# EAGLE design MegaShield (EAGLE 5.10)
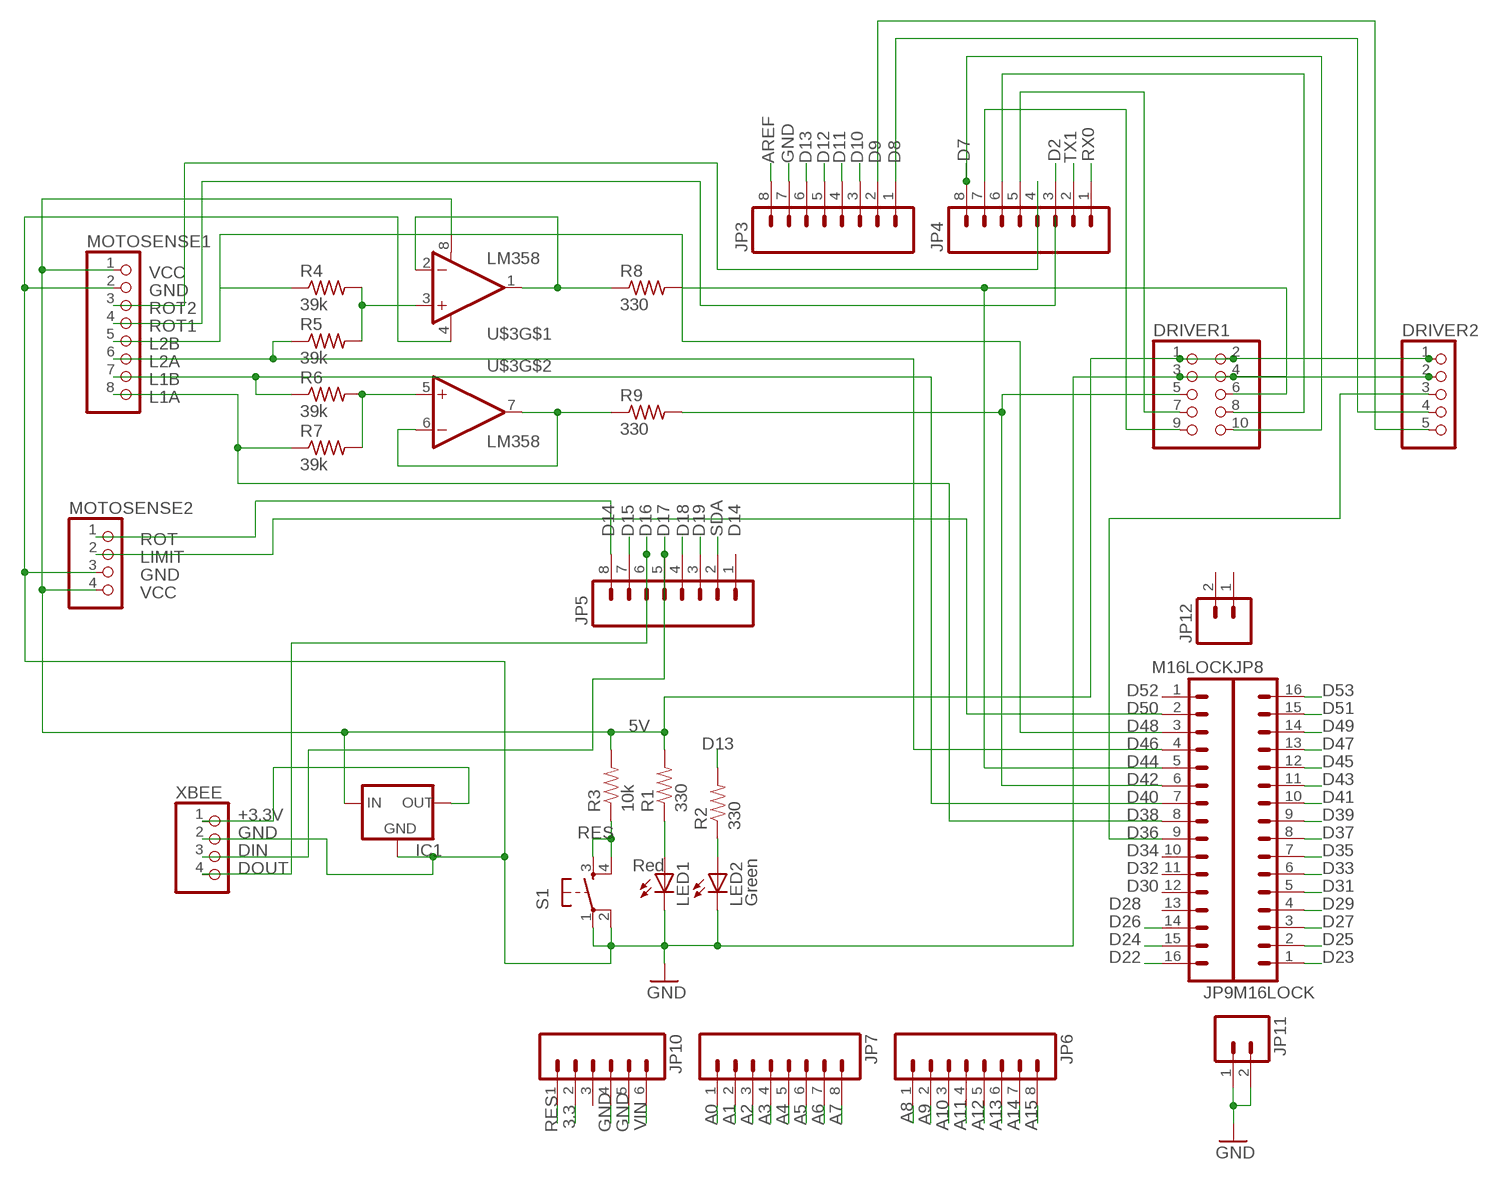
[diagram p0: schematic, sheet 1]

## Parts
DRIVER1  PINHD-2X5  [2X05]
DRIVER2  PINHD-1X5  [1X05]
IC1  V_REG_78XXSIDE  [78XXL]
JP3  M08LOCK  [1X08_LOCK]
JP4  M08LOCK  [1X08_LOCK]
JP5  M08LOCK  [1X08_LOCK]
JP6  M08LOCK  [1X08_LOCK]
JP7  M08LOCK  [1X08_LOCK]
JP8  M16LOCK  [1X16_LOCK]
JP9  M16LOCK  [1X16_LOCK]
JP10  M06LOCK  [1X06_LOCK]
JP11  M02LOCK  [1X02_LOCK]
JP12  M02LOCK  [1X02_LOCK]
LED1  Red  LED5MM  [LED5MM]
LED2  Green  LED5MM  [LED5MM]
MOTOSENSE1  PINHD-1X8/90  [1X08/90]
MOTOSENSE2  PINHD-1X4/90  [1X04/90]
R1  330  RESISTORPTH1  [AXIAL-0.3]
R2  330  RESISTORPTH1  [AXIAL-0.3]
R3  10k  RESISTORPTH1  [AXIAL-0.3]
R4  39k  R-US_0207/7  [0207/7]
R5  39k  R-US_0207/7  [0207/7]
R6  39k  R-US_0207/7  [0207/7]
R7  39k  R-US_0207/7  [0207/7]
R8  330  R-US_0204/7  [0204/7]
R9  330  R-US_0204/7  [0204/7]
S1  TAC_SWITCHPTH  [TACTILE-PTH]
U$3  LM358  [DIP08]
XBEE  PINHD-1X4/90  [1X04/90]

## Nets
3.3: JP10.2
5V: DRIVER1.1 DRIVER1.2 DRIVER2.1 IC1.IN MOTOSENSE1.1 MOTOSENSE2.4 R1.P$2 R3.P$2 U$3.8(V+)
A0: JP7.1
A1: JP7.2
A2: JP7.3
A3: JP7.4
A4: JP7.5
A5: JP7.6
A6: JP7.7
A7: JP7.8
A8: JP6.1
A9: JP6.2
A10: JP6.3
A11: JP6.4
A12: JP6.5
A13: JP6.6
A14: JP6.7
A15: JP6.8
AREF: JP3.8
D2: JP4.3
D7: DRIVER1.10 JP4.8
D8: DRIVER2.4 JP3.1
D9: DRIVER2.5 JP3.2
D10: JP3.3
D11: JP3.4
D12: JP3.5
D13: JP3.6 R2.P$2
D14: JP5.8 MOTOSENSE2.1
D15: JP5.7
D16: JP5.6 XBEE.4
D17: JP5.5 XBEE.3
D18: JP5.4
D19: JP5.3
D22: DRIVER2.3 JP9.9
D23: JP8.16
D24: DRIVER1.5 JP9.6 R9.2
D25: JP8.15
D27: JP8.14
D29: JP8.13
D31: JP8.12
D33: JP8.11
D35: JP8.10
D37: JP8.9
D39: JP8.8
D41: JP8.7
D43: JP8.6
D45: JP8.5
D47: JP8.4
D48: JP9.14
D49: JP8.3
D50: JP9.15
D51: JP8.2
D52: JP9.16
D53: JP8.1
GND: DRIVER1.3 DRIVER1.4 DRIVER2.2 IC1.GND JP3.7 JP10.4 JP10.5 JP11.1 JP11.2 LED1.K(C) LED2.K(C) MOTOSENSE1.2 MOTOSENSE2.3 S1.1 S1.2 U$3.4(V-) XBEE.2
N$1: JP9.4 MOTOSENSE1.6 R5.1
N$3: JP9.7 MOTOSENSE1.7 R6.1
N$4: JP9.3 MOTOSENSE1.5 R4.1
N$5: R4.2 R5.2 U$3.3(+IN)
N$6: JP9.8 MOTOSENSE1.8 R7.1
N$8: DRIVER1.7 JP4.5
N$9: DRIVER1.6 JP9.5 R8.2
N$10: DRIVER1.8 JP4.6
N$11: DRIVER1.9 JP4.7
N$12: JP9.2 MOTOSENSE2.2
N$17: JP4.4 MOTOSENSE1.3
N$21: MOTOSENSE1.4
N$85: R6.2 R7.2 U$3.5(+IN)
N$97: R8.1 U$3.1(OUT) U$3.2(-IN)
N$108: R9.1 U$3.6(-IN) U$3.7(OUT)
N$109: IC1.OUT XBEE.1
N$126: LED1.A R1.P$1
N$127: LED2.A R2.P$1
RES: JP10.1 R3.P$1 S1.3 S1.4
RX0: JP4.1
SDA: JP5.2
TX1: JP4.2
VIN: JP10.6
Unconnected: JP5.1 JP9.1 JP9.10 JP9.11 JP9.12 JP9.13 JP10.3 JP12.1 JP12.2

## Notes on the sheet
- VCC
- GND
- ROT2
- ROT1
- L2B
- L2A
- L1B
- L1A
- ROT
- LIMIT
- GND
- VCC
- D52 | D53
- D50 | D51
- D48 | D49
- D46 | D47
- D44 | D45
- D42 | D43
- D40 | D41
- +3.3V | D38 | D39
- GND | D36 | D37
- DIN | D34 | D35
- DOUT | D32 | D33
- D30 | D31
- D28 | D29
- D26 | D27
- D24 | D25
- D22 | D23

## Library data of the parts
DRIVER1 = pinhead:PINHD-2X5: PIN HEADER
DRIVER2 = pinhead:PINHD-1X5: PIN HEADER
IC1 = SparkFun:V_REG_78XX: Voltage Regulator Standard 7805 5V regulator. IGO (Input Ground Output). Spark Fun Electronics SKU : COM-00107
JP3-JP7 = SparkFun:M08: Header 8 Standard 8-pin 0.1" header. Use with straight break away headers (SKU : PRT-00116), right angle break away headers (PRT-00553), swiss pins (PRT-00743), machine pins (PRT-00117), and female headers (PRT-00115).
JP8 JP9 = SparkFun:M16
JP10 = SparkFun:M06: Header 6 Standard 6-pin 0.1" header. Use with straight break away headers (SKU : PRT-00116), right angle break away headers (PRT-00553), swiss pins (PRT-00743), machine pins (PRT-00117), and female headers (PRT-00115). Molex polarized connector foot print use with SKU : PRT-08094 with associated crimp pins and housings. NOTES ON THE VARIANTS LOCK and LOCK_LONGPADS... This footprint was designed to help hold the alignment of a through-hole component (i.e. 6-pin header) while soldering it into place. You may notice that each hole has been shifted either up or down by 0.005 of an inch from it's more standard position (which is a perfectly straight line). This slight alteration caused the pins (the squares in the middle) to touch the edges of the holes. Because they are alternating, it causes a "brace" to hold the component in place. 0.005 has proven to be the perfect amount of "off-center" position when using our standard breakaway headers. Although looks a little odd when you look at the bare footprint, once you have a header in there, the alteration is very hard to notice. Also, if you push a header all the way into place, it is covered up entirely on the bottom side. This idea of altering the position of holes to aid alignment will be further integrated into the Sparkfun Library for other footprints. It can help hold any component with 3 or more connection pins.
JP11 JP12 = SparkFun:M02: Header 2 Standard 2-pin 0.1" header. Use with straight break away headers (SKU : PRT-00116), right angle break away headers (PRT-00553), swiss pins (PRT-00743), machine pins (PRT-00117), and female headers (PRT-00115). Molex polarized connector foot print use with SKU : PRT-08233 with associated crimp pins and housings.
LED1 LED2 = SparkFun:LED: LEDs Standard schematic elements and footprints for 5mm, 3mm, 1206, and 0603 sized LEDs. 5mm - Spark Fun Electronics SKU : COM-00529 (and others)
MOTOSENSE1 = pinhead:PINHD-1X8: PIN HEADER
MOTOSENSE2 XBEE = pinhead:PINHD-1X4: PIN HEADER
R1-R3 = SparkFun:RESISTOR: Resistor Basic schematic elements and footprints for 0603, 1206, and PTH 1/10th watt (small) resistors.
R4-R9 = adafruit:R-US_: RESISTOR, American symbol
S1 = SparkFun:TAC_SWITCH: Momentary Switch Button commonly used for reset or general input. Spark Fun Electronics SKU : COM-00097
U$3 = SparkFun:LM358

## Net classes
0 default: width 0.152 mm, drill 0.305 mm, clearance 0.152 mm

## Board
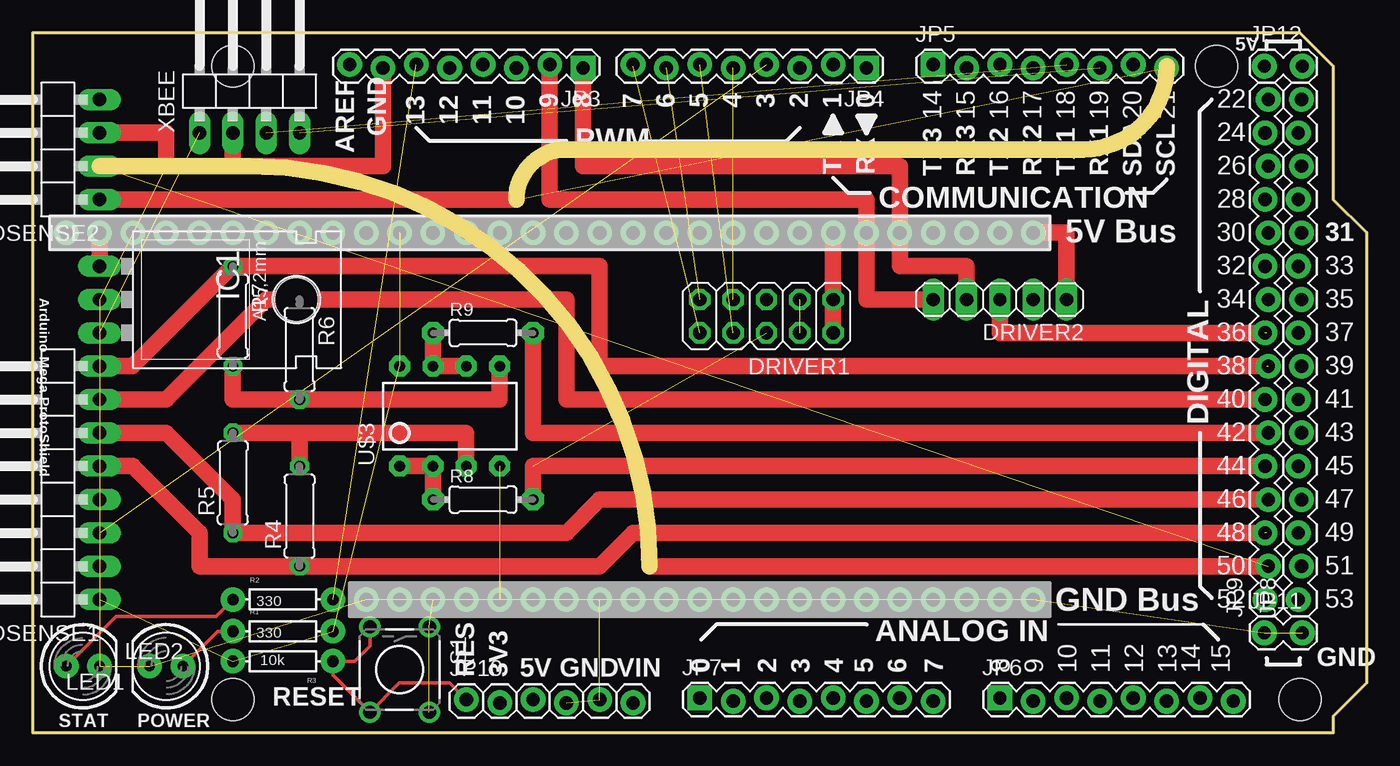
[diagram p1: board, top side]
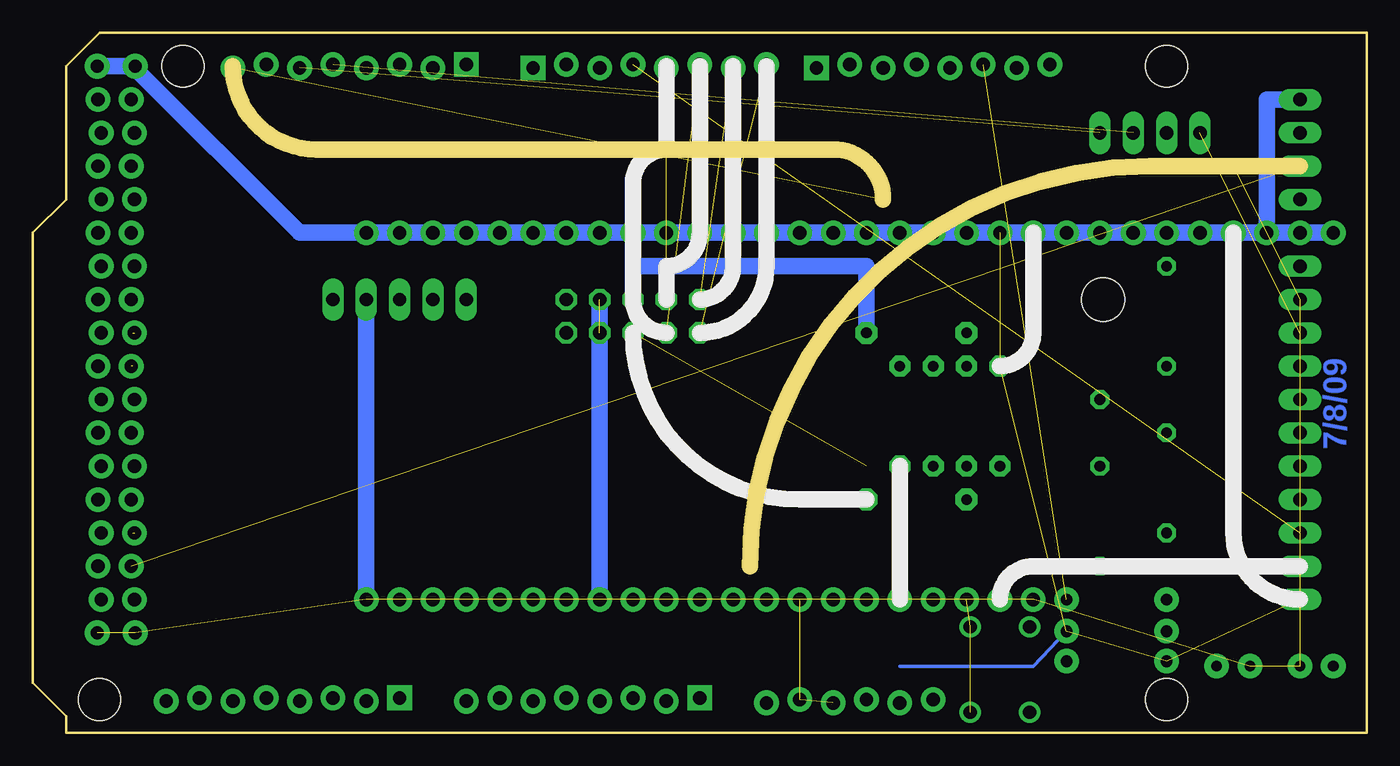
[diagram p2: board, bottom side, seen from below]

Size 101.6 x 53.34 mm. Coordinates in mm from the lower left corner, seen from the top.
Outline: 0,0 99.06,0 99.06,1.27 101.6,3.81 101.6,38.1 99.06,40.64 99.06,50.8 96.52,53.34 0,53.34 0,0
Copper layers (1*16): Top 0.035mm / dielectric 1.5mm / Bottom 0.035mm
Design rules "SparkFun": minimum track width 8mil, minimum drill 20mil, track to track 8mil, track to pad 8mil, pad to pad 8mil, via to via 8mil, smd to smd 8mil, copper to edge 10mil, drill to drill 8mil, minimum pad ring 12mil, minimum via ring 10mil, stop-mask expansion 4mil, vias tented up to drill 25mil, thermal gap 10mil
Holes 3.2 mm at 15.24,50.8 15.24,2.54 90.17,50.8 96.52,2.54
Milling: 5 lines

### Footprints (pad centres in the part's own frame; a part is rotated, then mirrored left to right if it is on the bottom)
2X05 = drill 1.016 octagon: 1 -5.08,-1.27; 2 -5.08,1.27; 3 -2.54,-1.27; 4 -2.54,1.27; 5 0,-1.27; 6 0,1.27; 7 2.54,-1.27; 8 2.54,1.27; 9 5.08,-1.27; 10 5.08,1.27
1X05 = drill 1.016 long: 1 -5.08,0; 2 -2.54,0; 3 0,0; 4 2.54,0; 5 5.08,0
78XXL = drill 1.016 long: GND 0,-3.81; IN -2.54,-3.81; OUT 2.54,-3.81 | hole 3.302: 0,11.176
1X08_LOCK = drill 1.016 pad 1.88 square: 1 0,0.127 | drill 1.016 pad 1.88 round: 2 2.54,-0.127; 3 5.08,0.127; 4 7.62,-0.127; 5 10.16,0.127; 6 12.7,-0.127; 7 15.24,0.127; 8 17.78,-0.127
1X16_LOCK = drill 1.016 pad 1.88 round: 1 0,0.127; 2 2.54,-0.127; 3 5.08,0.127; 4 7.62,-0.127; 5 10.16,0.127; 6 12.7,-0.127; 7 15.24,0.127; 8 17.78,-0.127; 9 20.32,0.127; 10 22.86,-0.127; 11 25.4,0.127; 12 27.94,-0.127; 13 30.48,0.127; 14 33.02,-0.127; 15 35.56,0.127; 16 38.1,-0.127
1X06_LOCK = drill 1.016 pad 1.88 round: 1 0,0; 2 2.54,-0.254; 3 5.08,0; 4 7.62,-0.254; 5 10.16,0; 6 12.7,-0.254
1X02_LOCK = drill 1.016 pad 1.88 round: 1 -0.178,0; 2 2.718,0
LED5MM = drill 0.813 pad 1.88 round: A -1.27,0; K 1.27,0
1X08/90 = drill 1.016 long: 1 -8.89,-3.81; 2 -6.35,-3.81; 3 -3.81,-3.81; 4 -1.27,-3.81; 5 1.27,-3.81; 6 3.81,-3.81; 7 6.35,-3.81; 8 8.89,-3.81
1X04/90 = drill 1.016 long: 1 -3.81,-3.81; 2 -1.27,-3.81; 3 1.27,-3.81; 4 3.81,-3.81
AXIAL-0.3 = drill 0.9 pad 1.88 round: P$1 -3.81,0; P$2 3.81,0
0207/7 = drill 0.813 octagon: 1 -3.81,0; 2 3.81,0
0204/7 = drill 0.813 pad 1.676 octagon: 1 -3.81,0; 2 3.81,0
TACTILE-PTH = drill 1.016 round: 1 -3.251,2.261; 2 3.251,2.261; 3 -3.251,-2.261; 4 3.251,-2.261
DIP08 = drill 0.813 pad 1.6 octagon: 1 -3.81,-3.81; 2 -1.27,-3.81; 3 1.27,-3.81; 4 3.81,-3.81; 5 3.81,3.81; 6 1.27,3.81; 7 -1.27,3.81; 8 -3.81,3.81

### Placement (x,y rotation side)
DRIVER1  55.88,31.75 180 top
DRIVER2  73.66,33.02 180 top
IC1  8.89,33.02 270 top
JP3  41.91,50.8 180 top
JP4  63.5,50.8 180 top
JP5  68.58,50.8 0 top
JP6  73.66,2.54 0 top
JP7  50.8,2.54 0 top
JP8  96.52,10.16 90 top
JP9  93.98,10.16 90 top
JP10  33.02,2.54 0 top
JP11  93.98,7.62 0 top
JP12  93.98,50.8 0 top
LED1  10.16,5.08 180 top
LED2  3.81,5.08 0 top
MOTOSENSE1  1.27,19.05 90 top
MOTOSENSE2  1.27,44.45 90 top
R1  19.05,7.75 0 top
R2  19.05,10.16 0 top
R3  19.05,5.46 180 top
R4  20.32,16.51 90 top
R5  15.24,19.05 90 top
R6  20.32,29.21 270 top
R7  15.24,31.75 270 top
R8  34.29,17.78 0 top
R9  34.29,30.48 0 top
S1  27.94,4.83 270 top
U$3  31.75,24.13 0 top
XBEE  16.51,49.53 0 top

### Tracks (layer width: path | path; a pad name or v marks a point on that pad's centre or on a via)
3.3
  Top 0.203: JP10.2 35.56,2.54 JP10.2
5V  (via drill 1.02 pad 1.88)  (4 unrouted)
  Top 1.27: DRIVER2.1 78.74,38.1 v76.2,38.1 | DRIVER1.2 DRIVER1.1 v60.96,38.1 | IC1.IN v5.08,38.1
  Bottom 0.254: R1.P$2 25.4,5.08 35.56,5.08
  Bottom 1.27: v7.62,38.1 v10.16,38.1 v12.7,38.1 v15.24,38.1 v17.78,38.1 v20.32,38.1 v22.86,38.1 v25.4,38.1 v27.94,38.1 v30.48,38.1 v33.02,38.1 v35.56,38.1 v38.1,38.1 v40.64,38.1 v43.18,38.1 v45.72,38.1 v48.26,38.1 v50.8,38.1 v53.34,38.1 v55.88,38.1 v58.42,38.1 v60.96,38.1 v63.5,38.1 v66.04,38.1 v68.58,38.1 v71.12,38.1 v73.66,38.1 v76.2,38.1 81.28,38.1 93.98,50.8 96.52,50.8 | v7.62,38.1 v5.08,38.1 v2.54,38.1 | v7.62,38.1 7.62,48.26 MOTOSENSE2.4
A0
  Top 0.203: JP7.1 50.8,2.54
A1
  Top 0.203: JP7.2 53.34,2.54 JP7.2
A2
  Top 0.203: JP7.3 55.88,2.54
A3
  Top 0.203: JP7.4 58.42,2.54 JP7.4
A4
  Top 0.203: JP7.5 60.96,2.54
A5
  Top 0.203: JP7.6 63.5,2.54 JP7.6
A6
  Top 0.203: JP7.7 66.04,2.54
A7
  Top 0.203: JP7.8 68.58,2.54 JP7.8
A8
  Top 0.203: JP6.1 73.66,2.54
A9
  Top 0.203: JP6.2 76.2,2.54 JP6.2
A10
  Top 0.203: JP6.3 78.74,2.54
A11
  Top 0.203: JP6.4 81.28,2.54 JP6.4
A12
  Top 0.203: JP6.5 83.82,2.54
A13
  Top 0.203: JP6.6 86.36,2.54 JP6.6
A14
  Top 0.203: JP6.7 88.9,2.54
A15
  Top 0.203: JP6.8 91.44,2.54 JP6.8
AREF
  Top 0.203: JP3.8 24.13,50.8 JP3.8
D2
  Top 0.203: JP4.3 58.42,50.8
D7  (1 unrouted)
  Top 0.203: JP4.8 45.72,50.8 JP4.8
D8
  Top 0.203: 41.91,50.8 JP3.1
  Top 1.27: DRIVER2.4 71.12,35.56 66.04,35.56 66.04,43.18 41.91,43.18 41.91,50.8
D9
  Top 0.203: 39.37,50.8 JP3.2
  Top 1.27: DRIVER2.5 63.5,33.02 63.5,40.64 39.37,40.64 39.37,50.8
D10
  Top 0.203: JP3.3 36.83,50.8
D11
  Top 0.203: JP3.4 34.29,50.8 JP3.4
D12
  Top 0.203: JP3.5 31.75,50.8
D13  (1 unrouted)
D14  (1 unrouted)
  Top 0.203: JP5.8 86.36,50.8
  Top 1.27: MOTOSENSE2.1 36.83,40.64
D15
  Top 0.203: JP5.7 83.82,50.8 JP5.7
D16  (1 unrouted)
  Top 0.203: JP5.6 81.28,50.8
D17  (1 unrouted)
  Top 0.203: JP5.5 78.74,50.8
D18
  Top 0.203: JP5.4 76.2,50.8
D19
  Top 0.203: JP5.3 73.66,50.8 JP5.3
D22  (1 unrouted)
  Top 1.27: DRIVER2.3 73.66,30.48 93.98,30.48
D24
  Top 1.27: R9.2 38.1,22.86 JP9.6
  Bottom 1.27: R9.2 38.1,35.56 55.88,35.56 DRIVER1.5
GND  (via drill 1.02 pad 1.88)  (33 unrouted)
  Top 1.27: MOTOSENSE2.3 10.16,45.72 10.16,43.18 15.24,43.18 | 15.24,43.18 XBEE.2 | JP3.7 26.67,43.18 15.24,43.18
  Bottom 1.27: v58.42,10.16 DRIVER1.3 | v76.2,10.16 DRIVER2.2
  other vias: 73.66,10.16 71.12,10.16 68.58,10.16 66.04,10.16 63.5,10.16 60.96,10.16 55.88,10.16 53.34,10.16 50.8,10.16 48.26,10.16 45.72,10.16 43.18,10.16 40.64,10.16 38.1,10.16 35.56,10.16 33.02,10.16 25.4,10.16 27.94,10.16 30.48,10.16
N$1
  Top 1.27: MOTOSENSE1.6 10.16,22.86 15.24,17.78 R5.1 40.64,15.24 43.18,17.78 JP9.4
N$3
  Top 1.27: MOTOSENSE1.7 10.16,25.4 17.78,33.02 R6.1 40.64,33.02 40.64,25.4 JP9.7
N$4  (1 unrouted)
  Top 1.27: MOTOSENSE1.5 7.62,20.32 12.7,15.24 12.7,12.7 R4.1 43.18,12.7 45.72,15.24 93.98,15.24
N$5
  Top 1.27: R5.2 20.32,22.86 | 20.32,22.86 R4.2 | 20.32,22.86 33.02,22.86 U$3.3
N$6  (1 unrouted)
  Top 1.27: MOTOSENSE1.8 7.62,27.94 R7.1 43.18,35.56 43.18,27.94 93.98,27.94
N$8  (1 unrouted)
N$9  (1 unrouted)
  Top 1.27: R8.2 38.1,20.32 JP9.5
N$10  (1 unrouted)
N$11  (1 unrouted)
N$12  (1 unrouted)
N$13
  Top 1.27: 93.98,12.7 46.99,12.7
N$17  (1 unrouted)
N$85
  Top 1.27: R7.2 15.24,25.4 R6.2 35.56,25.4 U$3.5
N$97
  Top 1.27: R8.1 U$3.2 U$3.1
N$108
  Top 1.27: R9.1 U$3.7 U$3.6
N$109  (1 unrouted)
N$126
  Top 0.254: R1.P$1 14.1,7.75 LED1.A
N$127
  Top 0.254: R2.P$1 13.97,8.89 6.35,8.89 LED2.A
RES
  Top 0.254: JP10.1 31.75,3.81 27.91,3.81 S1.4 22.86,4.39 R3.P$1 24.51,5.46 25.68,6.63 S1.3
RX0
  Top 0.203: JP4.1 63.5,50.8
SDA
  Top 0.203: JP5.2 71.12,50.8
TX1
  Top 0.203: JP4.2 60.96,50.8
VIN
  Top 0.203: JP10.6 45.72,2.54 JP10.6

### Text on the board
Bottom: 7/8/09
tPlace: 5V | 9 | 8 | 7 | 6 | 5 | 4 | 3 | 2 | 1 | 0 | 22 | 14 | 15 | 16 | 17 | 18 | 19 | 20 | 21 | 13 | 12 | 11 | 10 | GND | 24 | AREF | PWM | TX | RX | 26 | TX3 | RX3 | TX2 | RX2 | TX1 | RX1 | SDA | SCL | COMMUNICATION | 28 | 5V Bus | 30 | 31 | 32 | 33 | Arduino Mega ProtoShield | 34 | 35 | 36 | 37 | 38 | 39 | 40 | 41 | DIGITAL | 42 | 43 | 44 | 45 | 46 | 47 | 48 | 49 | 50 | 51 | 52 | 53 | GND Bus | ANALOG IN | 0 | 1 | 2 | 3 | 4 | 5 | 6 | 7 | 8 | 9 | 10 | 11 | 12 | 13 | 14 | 15 | GND | RES | 3V3 | 5V | GND | VIN | RESET | STAT | POWER